# Altium schematic sheet Balancer.SchDoc
size A4
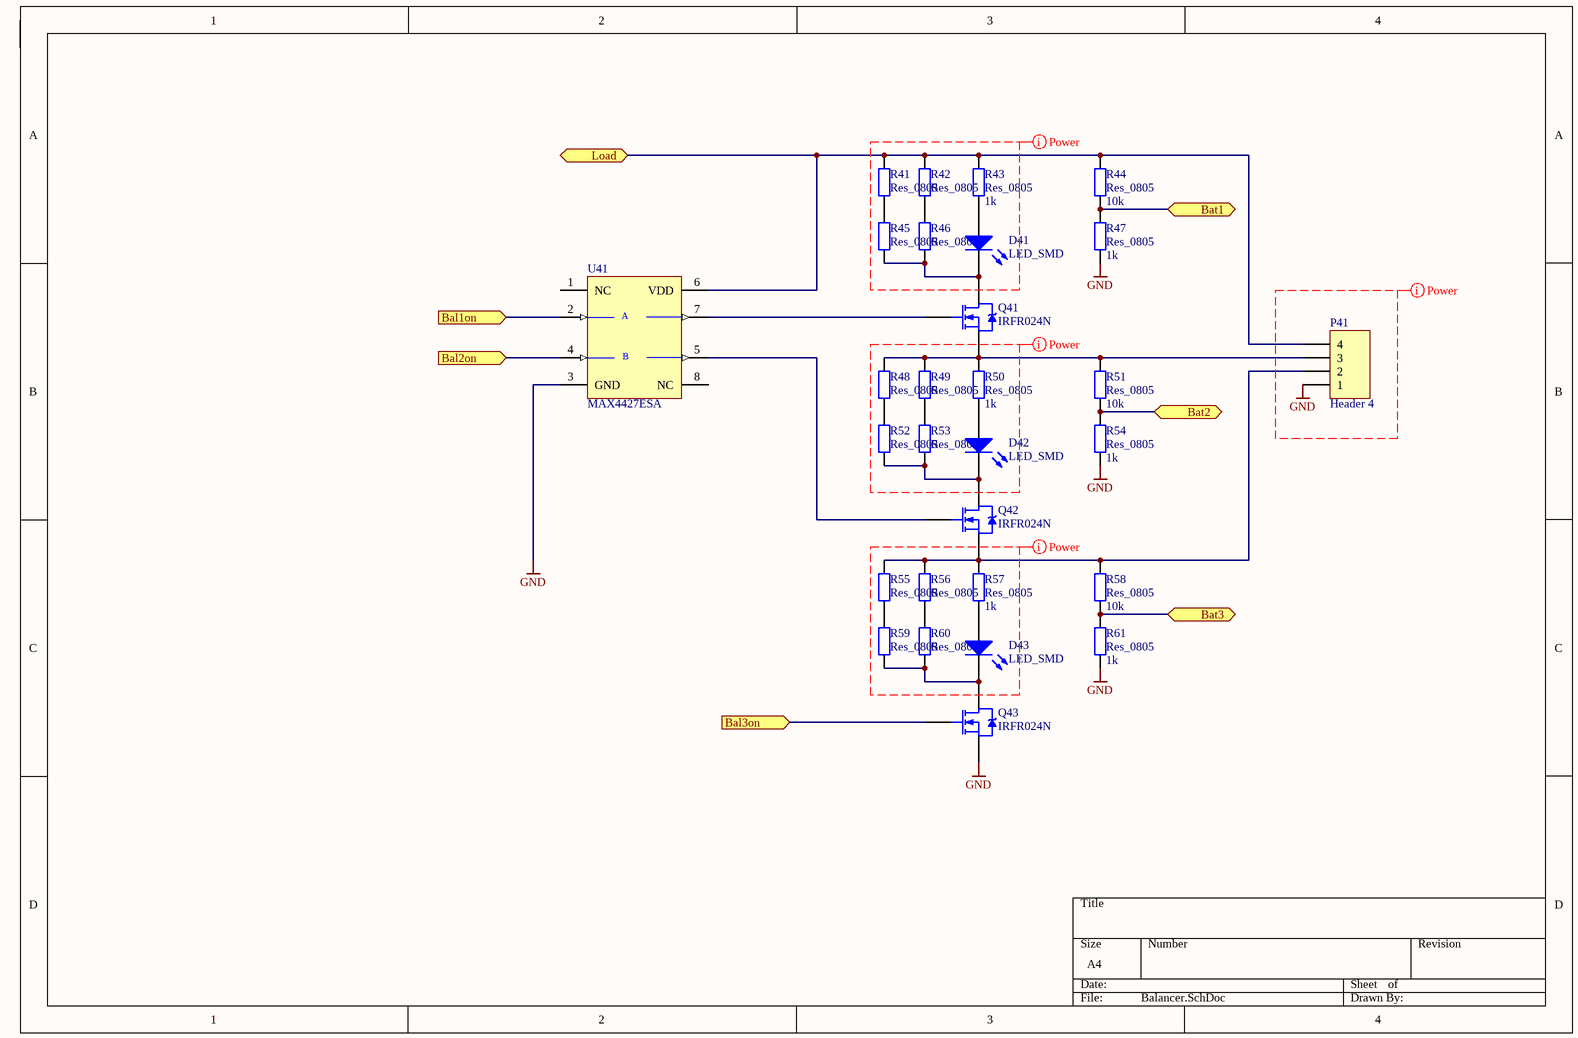
[diagram p0: Balancer.SchDoc]

## Parts
D41  LED_SMD  [LED_SMD]
D42  LED_SMD  [LED_SMD]
D43  LED_SMD  [LED_SMD]
P41  Header 4  [HDR1X4]
Q41  IRFR024N  [TO-252AA_N]
Q42  IRFR024N  [TO-252AA_N]
Q43  IRFR024N  [TO-252AA_N]
R41  Res_0805  [_0805]
R42  Res_0805  [_0805]
R43  Res_0805  value 1k  [_0805]
R44  Res_0805  value 10k  [_0805]
R45  Res_0805  [_0805]
R46  Res_0805  [_0805]
R47  Res_0805  value 1k  [_0805]
R48  Res_0805  [_0805]
R49  Res_0805  [_0805]
R50  Res_0805  value 1k  [_0805]
R51  Res_0805  value 10k  [_0805]
R52  Res_0805  [_0805]
R53  Res_0805  [_0805]
R54  Res_0805  value 1k  [_0805]
R55  Res_0805  [_0805]
R56  Res_0805  [_0805]
R57  Res_0805  value 1k  [_0805]
R58  Res_0805  value 10k  [_0805]
R59  Res_0805  [_0805]
R60  Res_0805  [_0805]
R61  Res_0805  value 1k  [_0805]
U41  MAX4427ESA  [NSO8_N]

## Ports
Bal1on (in), Bal2on (in), Bal3on (in), Bat1, Bat2, Bat3, Load

## Nets
GND: P41.1 Q43.3(S) R47.1 R54.1 R61.1 U41.3(GND)
Bal1on: U41.2(INA) ; port Bal1on
Bal2on: U41.4(INB) ; port Bal2on
Bal3on: Q43.1(G) ; port Bal3on
Bat1: R44.1 R47.2 ; port Bat1
Bat2: R51.1 R54.2 ; port Bat2
Bat3: R58.1 R61.2 ; port Bat3
Load: P41.4 R41.2 R42.2 R43.2 R44.2 U41.6(VDD) ; port Load
NetD41_1: D41.1 R43.1
NetD41_2: D41.2 Q41.4(D) R45.1 R46.1
NetD42_1: D42.1 R50.1
NetD42_2: D42.2 Q42.4(D) R52.1 R53.1
NetD43_1: D43.1 R57.1
NetD43_2: D43.2 Q43.4(D) R59.1 R60.1
NetP41_2: P41.2 Q42.3(S) R55.2 R56.2 R57.2 R58.2
NetP41_3: P41.3 Q41.3(S) R48.2 R49.2 R50.2 R51.2
NetQ41_1: Q41.1(G) U41.7(OUTA)
NetQ42_1: Q42.1(G) U41.5(OUTB)
NetR41_1: R41.1 R45.2
NetR42_1: R42.1 R46.2
NetR48_1: R48.1 R52.2
NetR49_1: R49.1 R53.2
NetR55_1: R55.1 R59.2
NetR56_1: R56.1 R60.2

Not connected (* = marked no-connect by the designer): U41 1(NC) 8(NC)

## Layout directives
net class Power: (no net found under the mark), GND

## Notes on the sheet
- (in symbol MAX4427ESA) A; B

## Library data of the parts
D41-D43 = DIODE_48: Type: LED; QR: 0; UID: DIODE_48; Name: LED_SMD; ComponentLink1URL: #NAME?; mounting: SMD
P41 = Con_33: QR: 0; UID: Con_33; Name: Header 4; mounting: THT; Pins: 1X4
Q41-Q43 = IRFR024N: HEXFET N-Channel Power MOSFET; Note: Pin 2 is trimmed and is electrically connected to Drain.; Published: 8-Jun-2000; LatestRevisionDate: 20-Nov-2009; LatestRevisionNote: IPC-7351 Footprint Added.; DatasheetVersion: Apr-1998; PackageVersion: Feb-2003; PackageReference: TO-252AA; Publisher: Altium Limited; PackageDescription: 3-Pin HEXFET Package 2.28 mm Pitch, 9.9 mm Lead Span; Code_JEDEC: TO-252-AA; ComponentLink1Description: Manufacturer Link; ComponentLink1URL: http://www.irf.com/
R41-R61 = Res_6: UID: Res_6; Name: Res_0805; ComponentLink1URL: #NAME?; mounting: SMD
U41 = MAX4427ESA: Dual High-Speed 1.5A MOSFET Driver; Published: 16-Jan-2001; LatestRevisionDate: 13-Apr-2006; LatestRevisionNote: IPC-7351 Footprint Added.; DatasheetVersion: Mar-1993; PackageReference: NSO8; Publisher: Altium Limited; PackageDescription: 8-Pin Small Outline Integrated Circuit 1.27 mm Pitch; Code_JEDEC: MS-012-AA; Code_IPC: SOIC127P600-8; ComponentLink1Description: Manufacturer Link; ComponentLink1URL: http://www.maxim-ic.com/; ComponentLink2Description: Datasheet; ComponentLink2URL: http://pdfserv.maxim-ic.com/en/ds/MAX4426-MAX4428.pdf